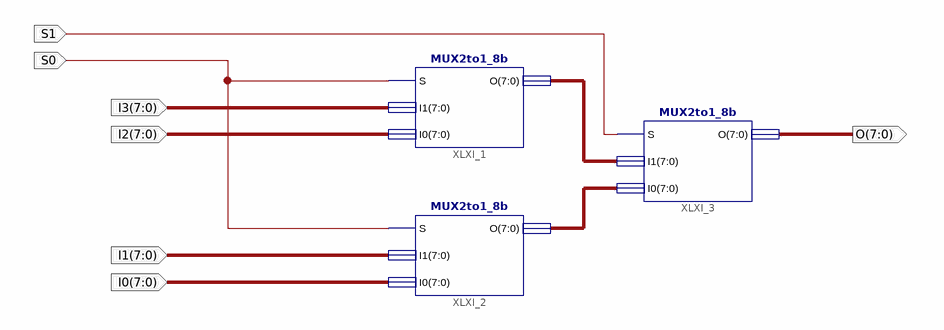
[diagram p0: schematic sheet 1]
// Xilinx ISE schematic Mux4to1_8b.sch (kintex7) as structural Verilog: 3 symbols, 7 ports
module Mux4to1_8b (
  input  [7:0] I3,
  input  [7:0] I1,
  input  [7:0] I0,
  input  [7:0] I2,
  input  S0,
  input  S1,
  output [7:0] O
);

  wire [7:0] XLXN_22, XLXN_23;

  MUX2to1_8b XLXI_1 (.S(S0), .I1(I3), .I0(I2), .O(XLXN_22));
  MUX2to1_8b XLXI_2 (.S(S0), .I1(I1), .I0(I0), .O(XLXN_23));
  MUX2to1_8b XLXI_3 (.S(S1), .I1(XLXN_22), .I0(XLXN_23), .O(O));
endmodule
